# EAGLE design myReaderB (EAGLE 7.4.0)
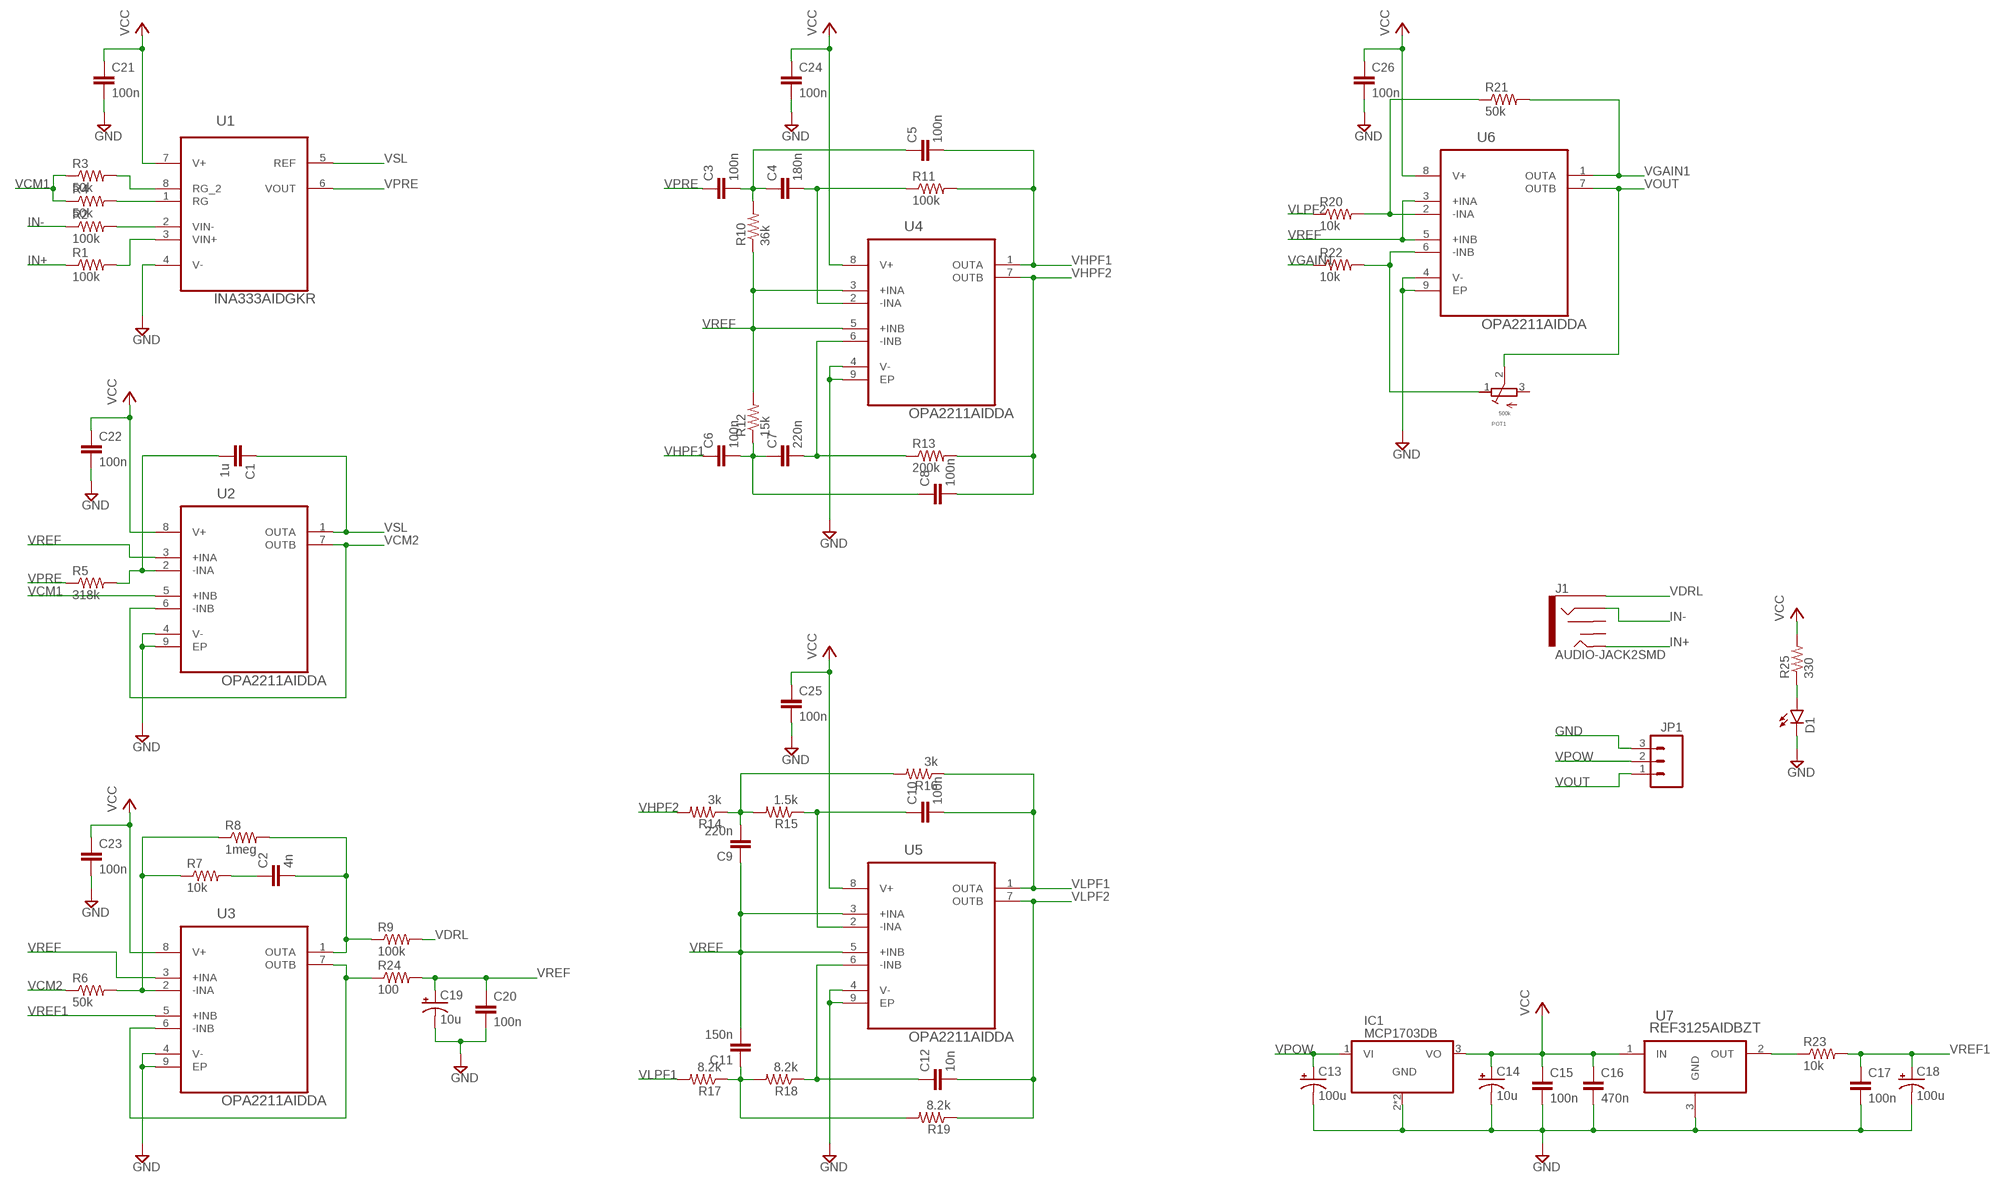
[diagram p0: schematic, sheet 1]

## Parts
C1  1u  CAP0402-CAP  [0402-CAP]
C2  4n  CAP0402-CAP  [0402-CAP]
C3  100n  CAP0402-CAP  [0402-CAP]
C4  180n  CAP0402-CAP  [0402-CAP]
C5  100n  CAP0402-CAP  [0402-CAP]
C6  100n  CAP0402-CAP  [0402-CAP]
C7  220n  CAP0402-CAP  [0402-CAP]
C8  100n  CAP0402-CAP  [0402-CAP]
C9  220n  CAP0402-CAP  [0402-CAP]
C10  100n  CAP0402-CAP  [0402-CAP]
C11  150n  CAP0402-CAP  [0402-CAP]
C12  10n  CAP0402-CAP  [0402-CAP]
C13  100u  CAP_POL1206  [EIA3216]
C14  10u  CAP_POL1206  [EIA3216]
C15  100n  CAP0402-CAP  [0402-CAP]
C16  470n  CAP0402-CAP  [0402-CAP]
C17  100n  CAP0402-CAP  [0402-CAP]
C18  100u  CAP_POL1206  [EIA3216]
C19  10u  CAP_POL1206  [EIA3216]
C20  100n  CAP0402-CAP  [0402-CAP]
C21  100n  CAP0402-CAP  [0402-CAP]
C22  100n  CAP0402-CAP  [0402-CAP]
C23  100n  CAP0402-CAP  [0402-CAP]
C24  100n  CAP0402-CAP  [0402-CAP]
C25  100n  CAP0402-CAP  [0402-CAP]
C26  100n  CAP0402-CAP  [0402-CAP]
D1  LED0603  [LED-0603]
IC1  MCP1703DB  [SOT223]
J1  AUDIO-JACK2SMD  [AUDIO-JACK-3.5MM-SMD]
JP1  M03PTH  [1X03]
POT1  500k  BOURN_SMD_POTENTIOMETER2.1X2.7MMPACKAGE  [BOURN_SMD_POTENTIOMETER]
R1  100k  RESISTOR0402-RES  [0402-RES]
R2  100k  RESISTOR0402-RES  [0402-RES]
R3  50k  RESISTOR0402-RES  [0402-RES]
R4  50k  RESISTOR0402-RES  [0402-RES]
R5  318k  RESISTOR0402-RES  [0402-RES]
R6  50k  RESISTOR0402-RES  [0402-RES]
R7  10k  RESISTOR0402-RES  [0402-RES]
R8  1meg  RESISTOR0402-RES  [0402-RES]
R9  100k  RESISTOR0402-RES  [0402-RES]
R10  36k  RESISTOR0402-RES  [0402-RES]
R11  100k  RESISTOR0402-RES  [0402-RES]
R12  15k  RESISTOR0402-RES  [0402-RES]
R13  200k  RESISTOR0402-RES  [0402-RES]
R14  3k  RESISTOR0402-RES  [0402-RES]
R15  1.5k  RESISTOR0402-RES  [0402-RES]
R16  3k  RESISTOR0402-RES  [0402-RES]
R17  8.2k  RESISTOR0402-RES  [0402-RES]
R18  8.2k  RESISTOR0402-RES  [0402-RES]
R19  8.2k  RESISTOR0402-RES  [0402-RES]
R20  10k  RESISTOR0402-RES  [0402-RES]
R21  50k  RESISTOR0402-RES  [0402-RES]
R22  10k  RESISTOR0402-RES  [0402-RES]
R23  10k  RESISTOR0402-RES  [0402-RES]
R24  100  RESISTOR0402-RES  [0402-RES]
R25  330  RESISTOR0402-RES  [0402-RES]
U1  INA333AIDGKR  [SOP65P490X110-8N]
U2  OPA2211AIDDA  [SOIC127P600X170-9N]
U3  OPA2211AIDDA  [SOIC127P600X170-9N]
U4  OPA2211AIDDA  [SOIC127P600X170-9N]
U5  OPA2211AIDDA  [SOIC127P600X170-9N]
U6  OPA2211AIDDA  [SOIC127P600X170-9N]
U7  REF3125AIDBZT  [SOT95P237X112-3N]

## Nets
GND: C13.C(-) C14.C(-) C15.2 C16.2 C17.2 C18.C(-) C19.C(-) C20.2 C21.2 C22.2 C23.2 C24.2 C25.2 C26.2 D1.C IC1.2(GND) IC1.4(GND) JP1.3 U1.4(V-) U2.4(V-) U2.9(EP) U3.4(V-) U3.9(EP) U4.4(V-) U4.9(EP) U5.4(V-) U5.9(EP) U6.4(V-) U6.9(EP) U7.3(GND)
IN+: J1.TIP R1.1
IN-: J1.RING R2.1
N$1: R1.2 U1.3(VIN+)
N$2: R2.2 U1.2(VIN-)
N$3: R20.2 R21.1 U6.2(-INA)
N$4: R4.2 U1.1(RG)
N$5: R6.2 R7.1 R8.1 U3.2(-INA)
N$6: C1.2 R5.2 U2.2(-INA)
N$7: C4.2 R11.1 U4.2(-INA)
N$8: C2.1 R7.2
N$9: C2.2 R8.2 R9.1 U3.1(OUTA)
N$10: C3.2 C4.1 C5.1 R10.2
N$11: C10.1 R15.1 U5.2(-INA)
N$12: C9.2 R14.1 R15.2 R16.2
N$13: C7.2 R13.1 U4.6(-INB)
N$14: C6.2 C7.1 C8.1 R12.1
N$15: C12.1 R18.1 U5.6(-INB)
N$16: C11.1 R17.1 R18.2 R19.2
N$17: R3.2 U1.8(RG_2)
N$18: D1.A R25.1
N$19: POT1.1(A) R22.2 U6.6(-INB)
N$20: R24.1 U3.6(-INB) U3.7(OUTB)
N$21: R23.1 U7.2(OUT)
VCC: C14.A(+) C15.1 C16.1 C21.1 C22.1 C23.1 C24.1 C25.1 C26.1 IC1.3(VO) R25.2 U1.7(V+) U2.8(V+) U3.8(V+) U4.8(V+) U5.8(V+) U6.8(V+) U7.1(IN)
VCM1: R3.1 R4.1 U2.5(+INB)
VCM2: R6.1 U2.6(-INB) U2.7(OUTB)
VDRL: J1.SLEEVE R9.2
VGAIN1: R21.2 R22.1 U6.1(OUTA)
VHPF1: C5.2 C6.1 R11.2 U4.1(OUTA)
VHPF2: C8.2 R13.2 R14.2 U4.7(OUTB)
VLPF1: C10.2 R16.1 R17.2 U5.1(OUTA)
VLPF2: C12.2 R19.1 R20.1 U5.7(OUTB)
VOUT: JP1.1 POT1.2(S) U6.7(OUTB)
VPOW: C13.A(+) IC1.1(VI) JP1.2
VPRE: C3.1 R5.1 U1.6(VOUT)
VREF: C9.1 C11.2 C19.A(+) C20.1 R10.1 R12.2 R24.2 U2.3(+INA) U3.3(+INA) U4.3(+INA) U4.5(+INB) U5.3(+INA) U5.5(+INB) U6.3(+INA) U6.5(+INB)
VREF1: C17.1 C18.A(+) R23.2 U3.5(+INB)
VSL: C1.1 U1.5(REF) U2.1(OUTA)
Unconnected: J1.RSH J1.TSH POT1.3(E)

## Library data of the parts
C1-C12 C15-C17 C20-C26 = SparkFun-Passives:CAP: Capacitor Standard 0603 ceramic capacitor, and 0.1" leaded capacitor.
C13 C14 C18 C19 = SparkFun-Passives:CAP_POL: Capacitor Polarized These are standard SMD and PTH capacitors. Normally 10uF, 47uF, and 100uF in electrolytic and tantalum varieties. Always verify the external diameter of the through hole cap, it varies with capacity, voltage, and manufacturer. The EIA devices should be standard.
D1 = SparkFun-LED:LED: LEDs Standard schematic elements and footprints for 5mm, 3mm, 1206, and 0603 sized LEDs. 5mm - Spark Fun Electronics SKU : COM-00529 (and others)
IC1 = linear:MCP1703: 250 mA, 16V, Low Quiescent Current LDO Regulator Source: http://ww1.microchip.com/downloads/en/DeviceDoc/22049b.pdf
J1 = SparkFun-Connectors:AUDIO-JACK2: Stereo audio jack with bypass switches. SMT version used on LilyPad MP3 board.; PROD_ID: CONN-10353
JP1 = SparkFun-Connectors:M03: Header 3 Standard 3-pin 0.1" header. Use with straight break away headers (SKU : PRT-00116), right angle break away headers (PRT-00553), swiss pins (PRT-00743), machine pins (PRT-00117), and female headers (PRT-00115). Molex polarized connector foot print use with SKU : PRT-08232 with associated crimp pins and housings.
POT1 = bourn_smd_potentiometers:BOURN_SMD_POTENTIOMETER: Bourn : SMD Potentiometer Part #: PVZ2A103C04B00 Mouser: http://www.mouser.com/ProductDetail/Murata-Electronics/PVZ2A103C04B00/?qs=sGAEpiMZZMvygUB3GLcD7qR9snKKmVdv8nMA43nZMQ4%3d Digikey: http://www.digikey.com/scripts/dksearch/dksus.dll?pv7=2&k=PVZ2A103C04B00&mnonly=0&newproducts=0&ColumnSort=0&page=1&quantity=0&ptm=0&fid=0&pageSize=25 Dimensions: (2.1mm x 2.7mm) http://search.murata.co.jp/Ceramy/CatalogshowpageAction.do?sParam=PVZ2A&sKno=G002&sTblid=A002&sDirnm=A00X&sFilnm=PVZ2A4DM&sType=2&sLang=en&sNHinnm=PVZ2A103C04B00&sCapt=Dimensions
R1-R25 = SparkFun-Passives:RESISTOR: Resistor Basic schematic elements and footprints for 0603, 1206, and PTH resistors.
U1 = Texas_Instruments_By_element14_Batch_1:INA333AIDGKR: 0.05ìV/°C max, SINGLE-SUPPLY CMOS OPERATIONAL AMPLIFIERS Zer.-Drift Series; MPN: INA333AIDGKR; OC_FARNELL: 1631194; OC_NEWARK: 01P0907; PACKAGE: MSOP-8; SUPPLIER: Texas Instruments
U2-U6 = Texas_Instruments_By_element14_Batch_1:OPA2211AIDDA: Operational Amplifier; MPN: OPA2211AIDDA; OC_FARNELL: 1754985; OC_NEWARK: 24R9889; PACKAGE: SOIC-6; SUPPLIER: Texas Instruments
U7 = Texas_Instruments_By_element14_Batch_1:REF3125AIDBZT: SERIES VOLTAGE REFERENCE; MPN: REF3125AIDBZT; OC_FARNELL: 1470327; OC_NEWARK: 90H3373; PACKAGE: SOT23-3; SUPPLIER: Texas Instruments

## Board
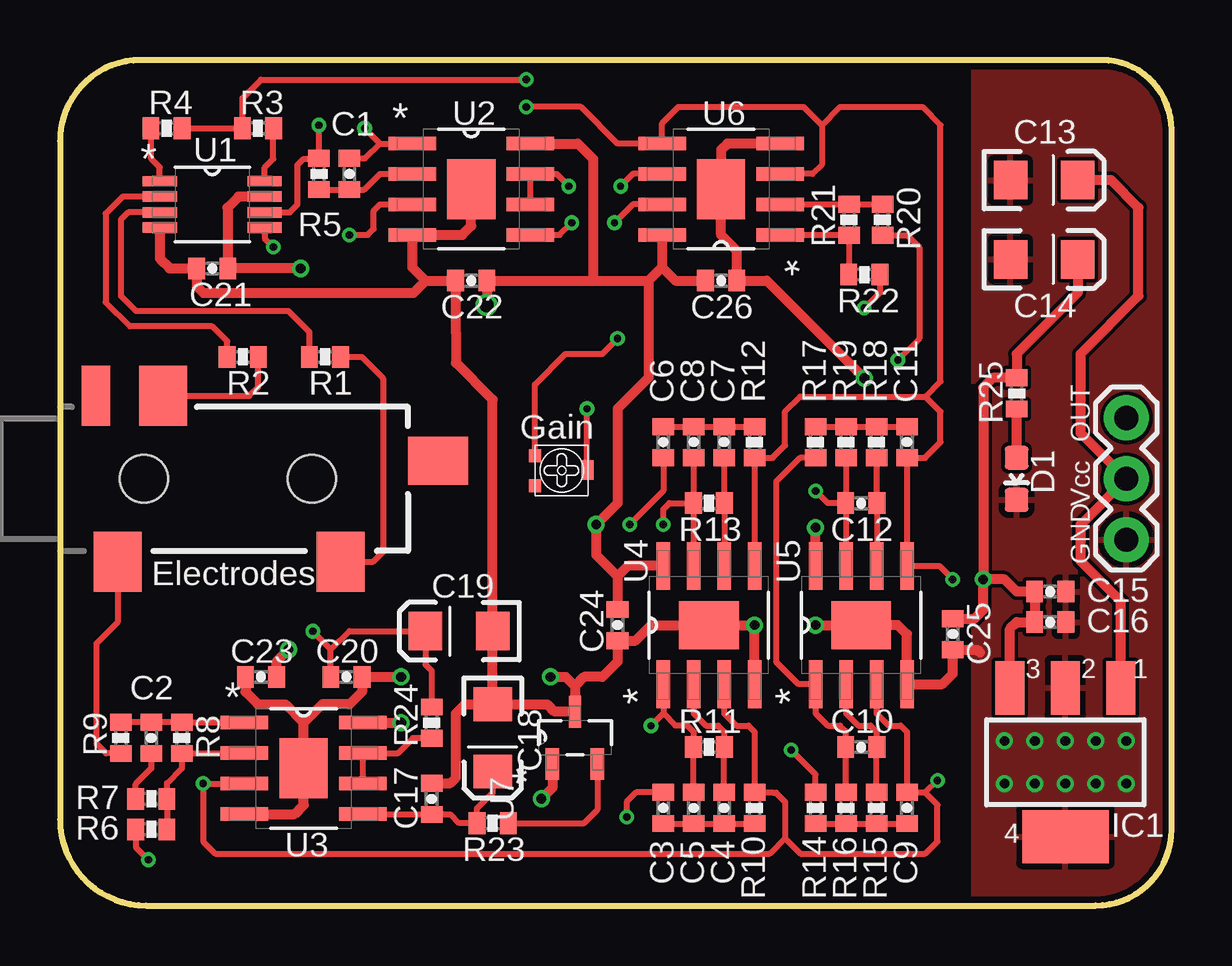
[diagram p1: board, top side]
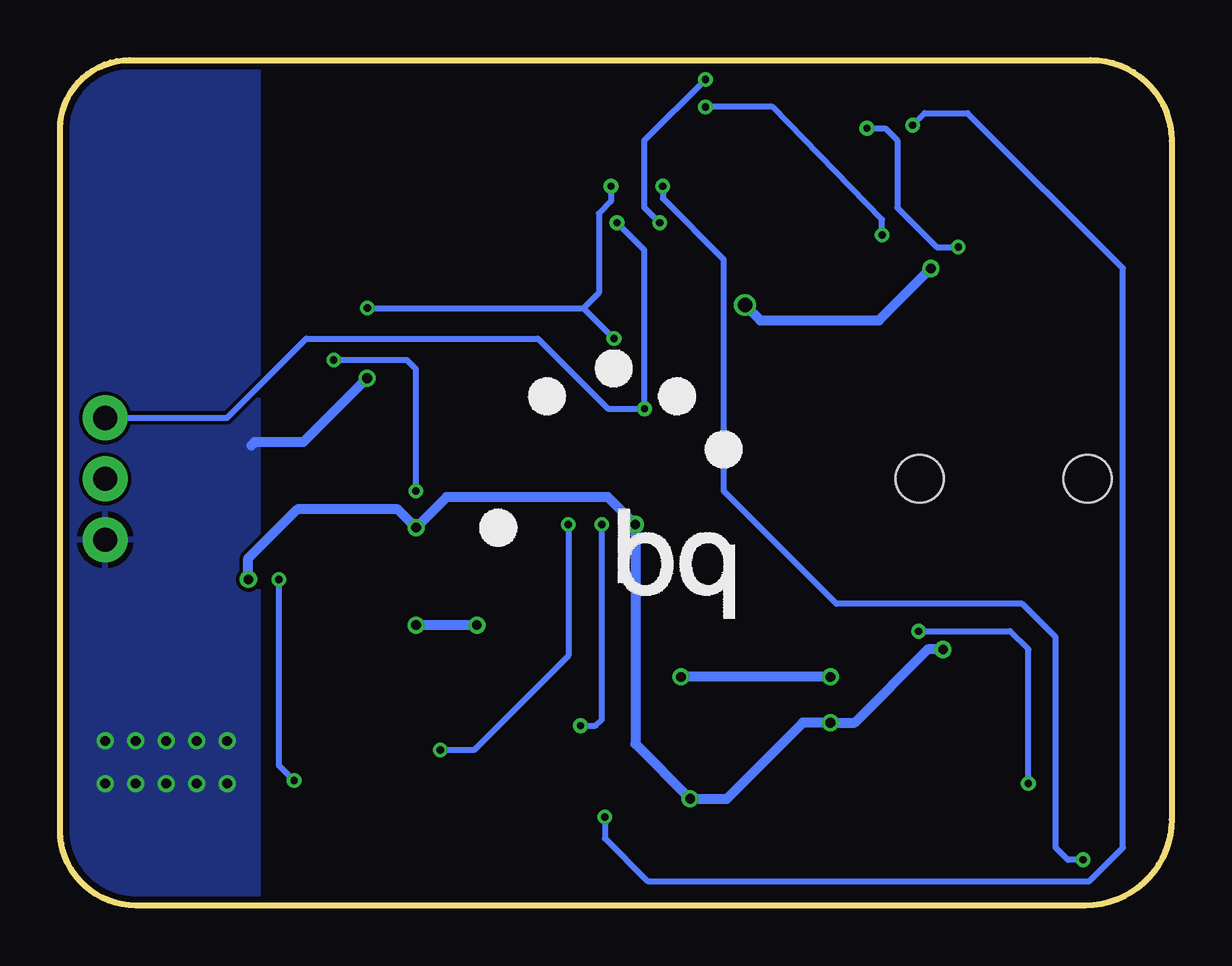
[diagram p2: board, bottom side, seen from below]

Size 46.34 x 35.23 mm. Coordinates in mm from the lower left corner, seen from the top.
Outline: 0,31.86 0,3.59 arc90 3.59,0 43.17,0 arc90 46.34,3.16 46.34,32.33 arc90 43.43,35.23 3.37,35.23 arc90 0,31.86
Copper layers (1*16): Top 0.035mm / dielectric 1.5mm / Bottom 0.035mm
Design rules "pighixxx_CAM_DRC_V1.0": minimum track width 6mil, minimum drill 12mil, track to track 6mil, track to pad 6mil, pad to pad 6mil, via to via 6mil, smd to smd 0mil, copper to edge 10mil, drill to drill 10mil, minimum pad ring 10mil, minimum via ring 6mil, stop-mask expansion 2mil, vias tented up to drill 100mil, thermal gap 10mil

### Footprints (pad centres in the part's own frame; a part is rotated, then mirrored left to right if it is on the bottom)
0402-CAP = smd 0.7 x 0.9: 1 -0.65,0; 2 0.65,0
EIA3216 = smd 1.4 x 1.6: A 1.4,0; C -1.4,0
LED-0603 = smd 1 x 1: A 0,-0.877; C 0,0.877
SOT223 = smd 1.219 x 2.235: 1 -2.311,-3.099; 2 0,-3.099; 3 2.311,-3.099 | smd 3.6 x 2.2: 4 0,3.099
AUDIO-JACK-3.5MM-SMD = smd 2 x 2.5: RING 4.3,3.45; SLEEVE 2.4,-3.45; TIP 11.7,-3.45 | smd 1.2 x 2.5: RSH 1.5,3.45 | smd 2.5 x 2: TSH 15.75,0.75 | hole 2: 3.5,0; 10.5,0
1X03 = drill 1.016 pad 1.88: 1 0,0; 2 2.54,0; 3 5.08,0
BOURN_SMD_POTENTIOMETER = smd 0.55 x 0.5: 1 0.432,-0.018; 3 1.682,-0.018 | smd 0.8 x 0.5: 2 1.032,2.182
0402-RES = smd 0.7 x 0.9: 1 -0.65,0; 2 0.65,0
SOP65P490X110-8N = smd 1.422 x 0.432: 1 -2.184,0.965; 2 -2.184,0.33; 3 -2.184,-0.33; 4 -2.184,-0.965; 5 2.184,-0.965; 6 2.184,-0.33; 7 2.184,0.33; 8 2.184,0.965
SOIC127P600X170-9N = smd 1.981 x 0.559: 1 -2.464,1.905; 2 -2.464,0.635; 3 -2.464,-0.635; 4 -2.464,-1.905; 5 2.464,-1.905; 6 2.464,-0.635; 7 2.464,0.635; 8 2.464,1.905 | smd 2.007 x 2.489: 9 0,0
SOT95P237X112-3N = smd 1.321 x 0.559: 1 -1.092,0.94; 2 -1.092,-0.94 | smd 1.321 x 0.508: 3 1.092,0

### Placement (x,y rotation side)
C1  12.06,30.48 270 top
C2  3.81,6.99 90 top
C3  25.15,4.06 270 top
C4  27.69,4.06 90 top
C5  26.42,4.06 90 top
C6  25.15,19.3 90 top
C7  27.69,19.3 270 top
C8  26.42,19.3 270 top
C9  35.31,4.06 270 top
C10  33.4,6.6 180 top
C11  35.31,19.3 270 top
C12  33.4,16.76 180 top
C13  41.02,30.23 0 top
C14  41.02,26.92 0 top
C15  41.27,13.08 0 top
C16  41.27,11.81 0 top
C17  15.49,4.45 90 top
C18  18.03,6.99 270 top
C19  16.64,11.43 180 top
C20  11.94,9.53 0 top
C21  6.35,26.54 180 top
C22  17.14,26.04 180 top
C23  8.38,9.53 180 top
C24  23.24,11.68 270 top
C25  37.21,11.3 270 top
C26  27.56,26.04 0 top
D1  39.88,17.78 180 top
IC1  41.91,5.97 180 top
J1  0,17.78 0 top
JP1  44.45,20.32 270 top
POT1  19.81,19.18 270 top
R1  11.05,22.86 180 top
R2  7.62,22.86 180 top
R3  8.26,32.38 0 top
R4  4.45,32.38 180 top
R5  10.79,30.48 270 top
R6  3.81,3.17 0 top
R7  3.81,4.45 180 top
R8  5.08,6.99 90 top
R9  2.54,6.99 270 top
R10  28.96,4.06 270 top
R11  27.05,6.6 180 top
R12  28.96,19.3 270 top
R13  27.05,16.76 180 top
R14  31.5,4.06 90 top
R15  34.04,4.06 270 top
R16  32.77,4.06 270 top
R17  31.5,19.3 270 top
R18  34.04,19.3 90 top
R19  32.77,19.3 90 top
R20  34.29,28.57 90 top
R21  32.89,28.57 270 top
R22  33.53,26.29 0 top
R23  18.03,3.43 180 top
R24  15.49,7.62 90 top
R25  39.88,21.34 90 top
U1  6.35,29.21 0 top
U2  17.14,29.84 0 top
U3  10.16,5.71 0 top
U4  27.05,11.68 90 top
U5  33.4,11.68 90 top
U6  27.56,29.84 180 top
U7  21.46,6.99 90 top
U$1  [BQ_LOGO]  28.83,11.94 0 bottom

### Tracks (layer width: path | path; a pad name or v marks a point on that pad's centre or on a via)
GND  (via drill 0.41)
  Top 0.406: U3.4 9.78,3.81 10.16,4.19 U3.9 10.16,7.62 | U1.4 4.17,26.95 4.57,26.54 C21.2 5.7,25.8 5.97,25.53 14.73,25.53 15.24,26.04 | 15.24,26.04 C22.2 16.5,23.89 16.51,23.88 16.51,22.61 18.04,21.08 C19.C C18.C | 15.24,26.04 14.68,26.59 U2.4 16.76,27.94 17.14,28.32 U2.9 | U6.4 27.81,31.75 27.56,31.5 U6.9 27.56,27.94 28.21,27.29 C26.2 29.46,26.04 v33.53,21.97 | v14.22,9.53 C20.2 12.59,8.9 12.06,8.38 10.92,8.38 10.16,7.62 | v20.45,9.53 21.08,9.53 21.46,9.14 | 21.46,9.14 U7.3 20.62,8.08 20.32,8.38 C18.C | C17.2 16.27,5.09 16.51,5.33 16.51,8 16.89,8.38 C18.C | C23.2 7.73,8.9 8.26,8.38 9.4,8.38 10.16,7.62 | 21.46,9.14 21.84,9.53 22.61,9.53 23.24,10.16 C24.2 23.99,11.03 24.64,11.68 U4.9 v28.96,11.68 U4.4 | v31.5,11.68 U5.9 34.92,11.68 35.31,11.3 U5.4 36.78,9.22 37.21,9.65 C25.2 38.24,10.65 38.35,10.54 | 41.92,9.08 IC1.2 | D1.C
  Bottom 0.406: v14.22,9.53 v20.45,9.53 | v28.96,11.68 v31.5,11.68 | v33.53,21.97 36.2,19.3 38.23,19.3 38.35,19.18
  other vias: 41.91,5.08 41.91,6.86 39.37,6.86 40.64,6.86 43.18,6.86 44.45,6.86 44.45,5.08 43.18,5.08 40.64,5.08 39.37,5.08
  pour Top: 46.99,35.56 38.1,35.56 38.1,0 46.99,0
  pour Bottom (isolate 0.127): 46.99,35.56 38.1,35.56 38.1,0 46.99,0
IN+
  Top 0.254: R1.1 12.57,22.86 13.46,21.97 13.46,14.73 13.06,14.33 J1.TIP
IN-
  Top 0.254: J1.RING 7.89,21.23 8.26,21.59 8.26,22.84 R2.1
N$1
  Top 0.254: U1.3 2.85,28.88 2.54,28.57 2.54,25.4 3.17,24.77 9.53,24.77 10.4,23.89 R1.2
N$2
  Top 0.254: R2.2 6.97,23.51 6.35,24.13 2.92,24.13 1.91,25.15 1.91,28.83 2.62,29.54 U1.2
N$3
  Top 0.254: U6.2 32.88,29.21 R21.1 R20.2
N$4
  Top 0.254: U1.1 4.17,30.76 3.81,31.11 R4.2
N$5
  Top 0.254: U3.2 7.68,6.33 R8.1 5.08,5.71 4.46,5.09 R7.1 R6.2
N$6
  Top 0.254: U2.2 13.34,30.48 12.69,29.83 C1.2 R5.2
N$7
  Top 0.254: C4.2 27.69,6.59 R11.1 27.7,7.22 27.43,7.49 26.92,7.49 26.42,8 U4.2
N$8
  Top 0.254: C2.1 3.81,5.71 3.16,5.07 R7.2
N$9
  Top 0.254: U3.1 5.09,7.62 R8.2 C2.2 R9.1
N$10
  Top 0.254: C3.2 C5.1 C4.1 R10.2
N$11
  Top 0.254: R15.1 34.04,6.59 C10.1 34.05,7.22 33.78,7.49 33.27,7.49 32.77,8 U5.2
N$12
  Top 0.254: R14.1 R16.2 R15.2 C9.2
N$13
  Top 0.254: C7.2 27.69,16.78 R13.1 27.7,14.16 U4.6
N$14
  Top 0.254: C6.2 C8.1 C7.1 R12.1
N$15
  Top 0.254: R18.1 34.04,16.78 C12.1 34.05,14.16 U5.6
N$16
  Top 0.254: R17.1 R19.2 R18.2 C11.1
N$17
  Top 0.254: U1.8 8.53,30.76 8.89,31.11 8.89,32.37 R3.2
N$18
  Top 0.406: D1.A R25.1
N$19  (via drill 0.3)
  Top 0.254: POT1.1 19.79,21.7 21.08,22.99 22.61,22.99 v23.24,23.62 | R22.2 34.18,25.54 v33.53,24.89 | U6.6 23.88,30.48 v23.37,29.97
  Bottom 0.254: v33.53,24.89 24.51,24.89 | v23.37,29.97 23.37,29.34 23.88,28.83 23.88,25.53 24.51,24.89 | v23.24,23.62 24.51,24.89
N$20
  Top 0.254: U3.6 U3.7 14.1,6.35 14.72,6.97 R24.1
N$21
  Top 0.254: R23.1 21.84,3.43 22.4,3.99 U7.2
VCC  (via drill 0.41, 0.6)
  Top 0.406: U1.7 7.44,29.54 6.99,29.08 6.99,26.56 C21.1 v10.03,26.54 | 22.23,26.04 C22.1 17.8,25.03 v17.78,25.02 | 22.23,26.04 24.54,26.04 | U6.8 25.09,26.59 | 25.09,26.59 25.65,26.04 C26.1 | 24.54,26.04 25.09,26.59 | U2.8 21.59,31.75 22.23,31.11 22.23,26.04 | 24.54,26.04 24.54,22 23.24,20.7 23.24,16.76 v22.35,15.88 22.35,14.61 23.24,13.72 | U3.8 v14.22,7.62 | U7.1 20.52,4.9 v20.07,4.45 | C23.1 9.03,10.18 v9.53,10.67 | U4.8 23.67,14.15 23.24,13.72 | 23.24,13.72 C24.1 | U5.8 v31.5,15.75 | C25.1 38.12,11.95 38.48,12.32 v38.48,13.59 | IC1.3 39.6,11.53 39.88,11.81 C16.1 C15.1 39.88,13.08 39.37,13.59 v38.48,13.59 | C14.A 42.42,25.53 39.88,22.99 R25.2 38.88,21.99 38.48,21.59 v38.48,13.59
  Bottom 0.406: v9.53,10.67 10.16,10.67 13.21,7.62 v14.22,7.62 15.37,7.62 18.54,4.45 v20.07,4.45 22.35,6.73 v22.35,15.88 23.5,17.02 30.23,17.02 v31.5,15.75 32.26,16.51 36.45,16.51 38.48,14.48 v38.48,13.59 | v10.03,26.54 12.19,24.38 17.14,24.38 v17.78,25.02
VCM1  (via drill 0.3)
  Top 0.254: R4.1 R3.1 7.61,33.64 8.38,34.42 v19.43,34.42 | U2.5 20.83,27.94 v21.34,28.45
  Bottom 0.254: v21.34,28.45 21.97,29.08 21.97,31.88 v19.43,34.42
VCM2  (via drill 0.3)
  Top 0.254: U2.6 U2.7 20.7,30.48 v21.21,29.97 | R6.1 3.16,2.43 v3.68,1.91
  Bottom 0.254: v3.68,1.91 4.32,1.91 4.83,2.41 4.83,11.18 6.22,12.57 13.97,12.57 18.67,17.27 18.67,26.92 21.21,29.46 v21.21,29.97
VDRL
  Top 0.254: R9.2 1.92,6.33 1.52,6.73 1.52,10.92 2.4,11.8 J1.SLEEVE
VGAIN1
  Top 0.254: U6.1 32.88,27.94 R21.2 32.89,26.3 R22.1
VHPF1  (via drill 0.3)
  Top 0.254: C5.2 26.42,6.59 R11.2 26.42,6.62 26.42,7.24 26.16,7.49 25.65,7.49 25.15,8 | C6.1 25.15,17.27 v23.75,15.88 | U4.1 25.15,8 | 25.15,8 v24.64,7.49
  Bottom 0.254: v24.64,7.49 24,7.49 23.75,7.75 v23.75,15.88
VHPF2  (via drill 0.3)
  Top 0.254: C8.2 26.42,16.78 R13.2 | R14.2 31.5,5.46 v30.48,6.48 | R13.2 26.4,14.16 U4.7 | v25.15,15.88 25.15,16.51 25.4,16.76 R13.2
  Bottom 0.254: v25.15,15.88 25.15,10.41 29.08,6.48 v30.48,6.48
VLPF1
  Top 0.254: R17.2 30.85,18.65 29.84,17.65 29.84,10.16 30.79,9.22 U5.1 31.5,8 32,7.49 32.51,7.49 32.75,7.25 C10.2 32.77,6.59 R16.1
VLPF2  (via drill 0.3)
  Top 0.254: R19.1 32.77,16.78 C12.2 | C12.2 32.75,14.16 U5.7 | R20.1 35.32,27.93 35.81,27.43 35.81,23.62 v34.92,22.73 | C12.2 32,16.76 v31.5,17.27
  Bottom 0.254: v31.5,17.27 31.5,22.35 31.88,22.73 v34.92,22.73
VOUT  (via drill 0.3)
  Top 0.254: POT1.2 21.97,18.17 v21.97,20.7 | U6.7 23.88,29.21 v23.11,28.45
  Bottom 0.254: v23.11,28.45 21.97,27.3 v21.97,20.7 23.5,20.7 26.42,23.62 36.07,23.62 39.37,20.32 JP1.1
VPOW
  Top 0.406: IC1.1 44.22,12.68 42.55,14.35 42.55,15.88 JP1.2 42.55,19.68 42.55,22.99 44.96,25.4 44.96,29.08 43.81,30.23 C13.A
VPRE  (via drill 0.3)
  Top 0.254: v10.79,32.51 R5.1 10.78,31.11 10.16,31.11 9.91,30.86 9.91,29.21 9.58,28.88 U1.6 | C3.1 24.02,4.71 23.62,4.32 v23.62,3.68
  Bottom 0.254: v10.79,32.51 10.29,33.02 8.51,33.02 2.03,26.54 2.03,2.41 3.43,1.02 21.84,1.02 23.62,2.79 v23.62,3.68
VREF  (via drill 0.3)
  Top 0.254: U4.5 R12.2 29.7,18.65 30.23,19.18 30.23,20.57 30.86,21.21 36.07,21.21 | 36.07,21.21 36.7,20.57 36.7,19.3 36.05,18.65 C11.2 U5.5 36.65,14.15 v37.21,13.59 | U4.3 27.69,8 28.19,7.49 28.7,7.49 28.96,7.24 R10.1 29.7,4.71 29.72,4.7 29.84,4.7 30.23,4.32 30.23,2.79 | U5.3 34.04,8 34.54,7.49 35.05,7.49 35.31,7.24 C9.1 36.05,4.71 | R24.2 15.49,9.78 15.24,10.04 C19.A 12.06,11.43 11.29,10.65 C20.1 11.29,10.68 v10.54,11.43 | 36.05,4.71 36.58,4.19 36.58,2.67 36.07,2.16 30.86,2.16 30.23,2.79 | 31.75,32.51 31.75,30.86 31.37,30.48 U6.3 | 31.75,32.51 30.99,33.27 25.78,33.27 25.09,32.59 U6.5 23.24,31.75 21.72,33.27 v19.43,33.27 | 31.75,32.51 32.51,33.27 35.94,33.27 36.7,32.51 36.7,21.84 36.07,21.21 | 30.23,2.79 29.59,2.16 6.48,2.16 5.97,2.67 v5.97,5.08 U3.3 | v12.06,27.94 12.83,27.94 13.08,28.19 13.08,28.96 13.34,29.21 U2.3 | 36.05,4.71 36.08,4.71 v36.58,5.21
  Bottom 0.254: v12.06,27.94 12.06,28.57 16.64,33.27 v19.43,33.27 | v10.54,11.43 6.73,11.43 5.97,10.67 v5.97,5.08 | v36.58,5.21 37.21,5.84 v37.21,13.59
VREF1
  Top 0.254: C17.1 16,3.79 | 16,3.79 16.27,3.79 16.64,3.43 R23.2 17.38,4.05 18.03,4.7 C18.A | U3.5 15.99,3.81 16,3.79
VSL  (via drill 0.3)
  Top 0.254: C1.1 12.71,31.13 13.34,31.75 | 13.34,31.75 U2.1 | v12.7,32.38 13.34,31.75 | U1.5 8.53,27.79 v8.89,27.43
  Bottom 0.254: v12.7,32.38 11.94,32.38 11.43,31.88 11.43,29.08 9.78,27.43 v8.89,27.43

### Text on the board
tNames: Gain | OUT | Vcc | GND | Electrodes